# EAGLE design 12input (EAGLE 6.5.0)
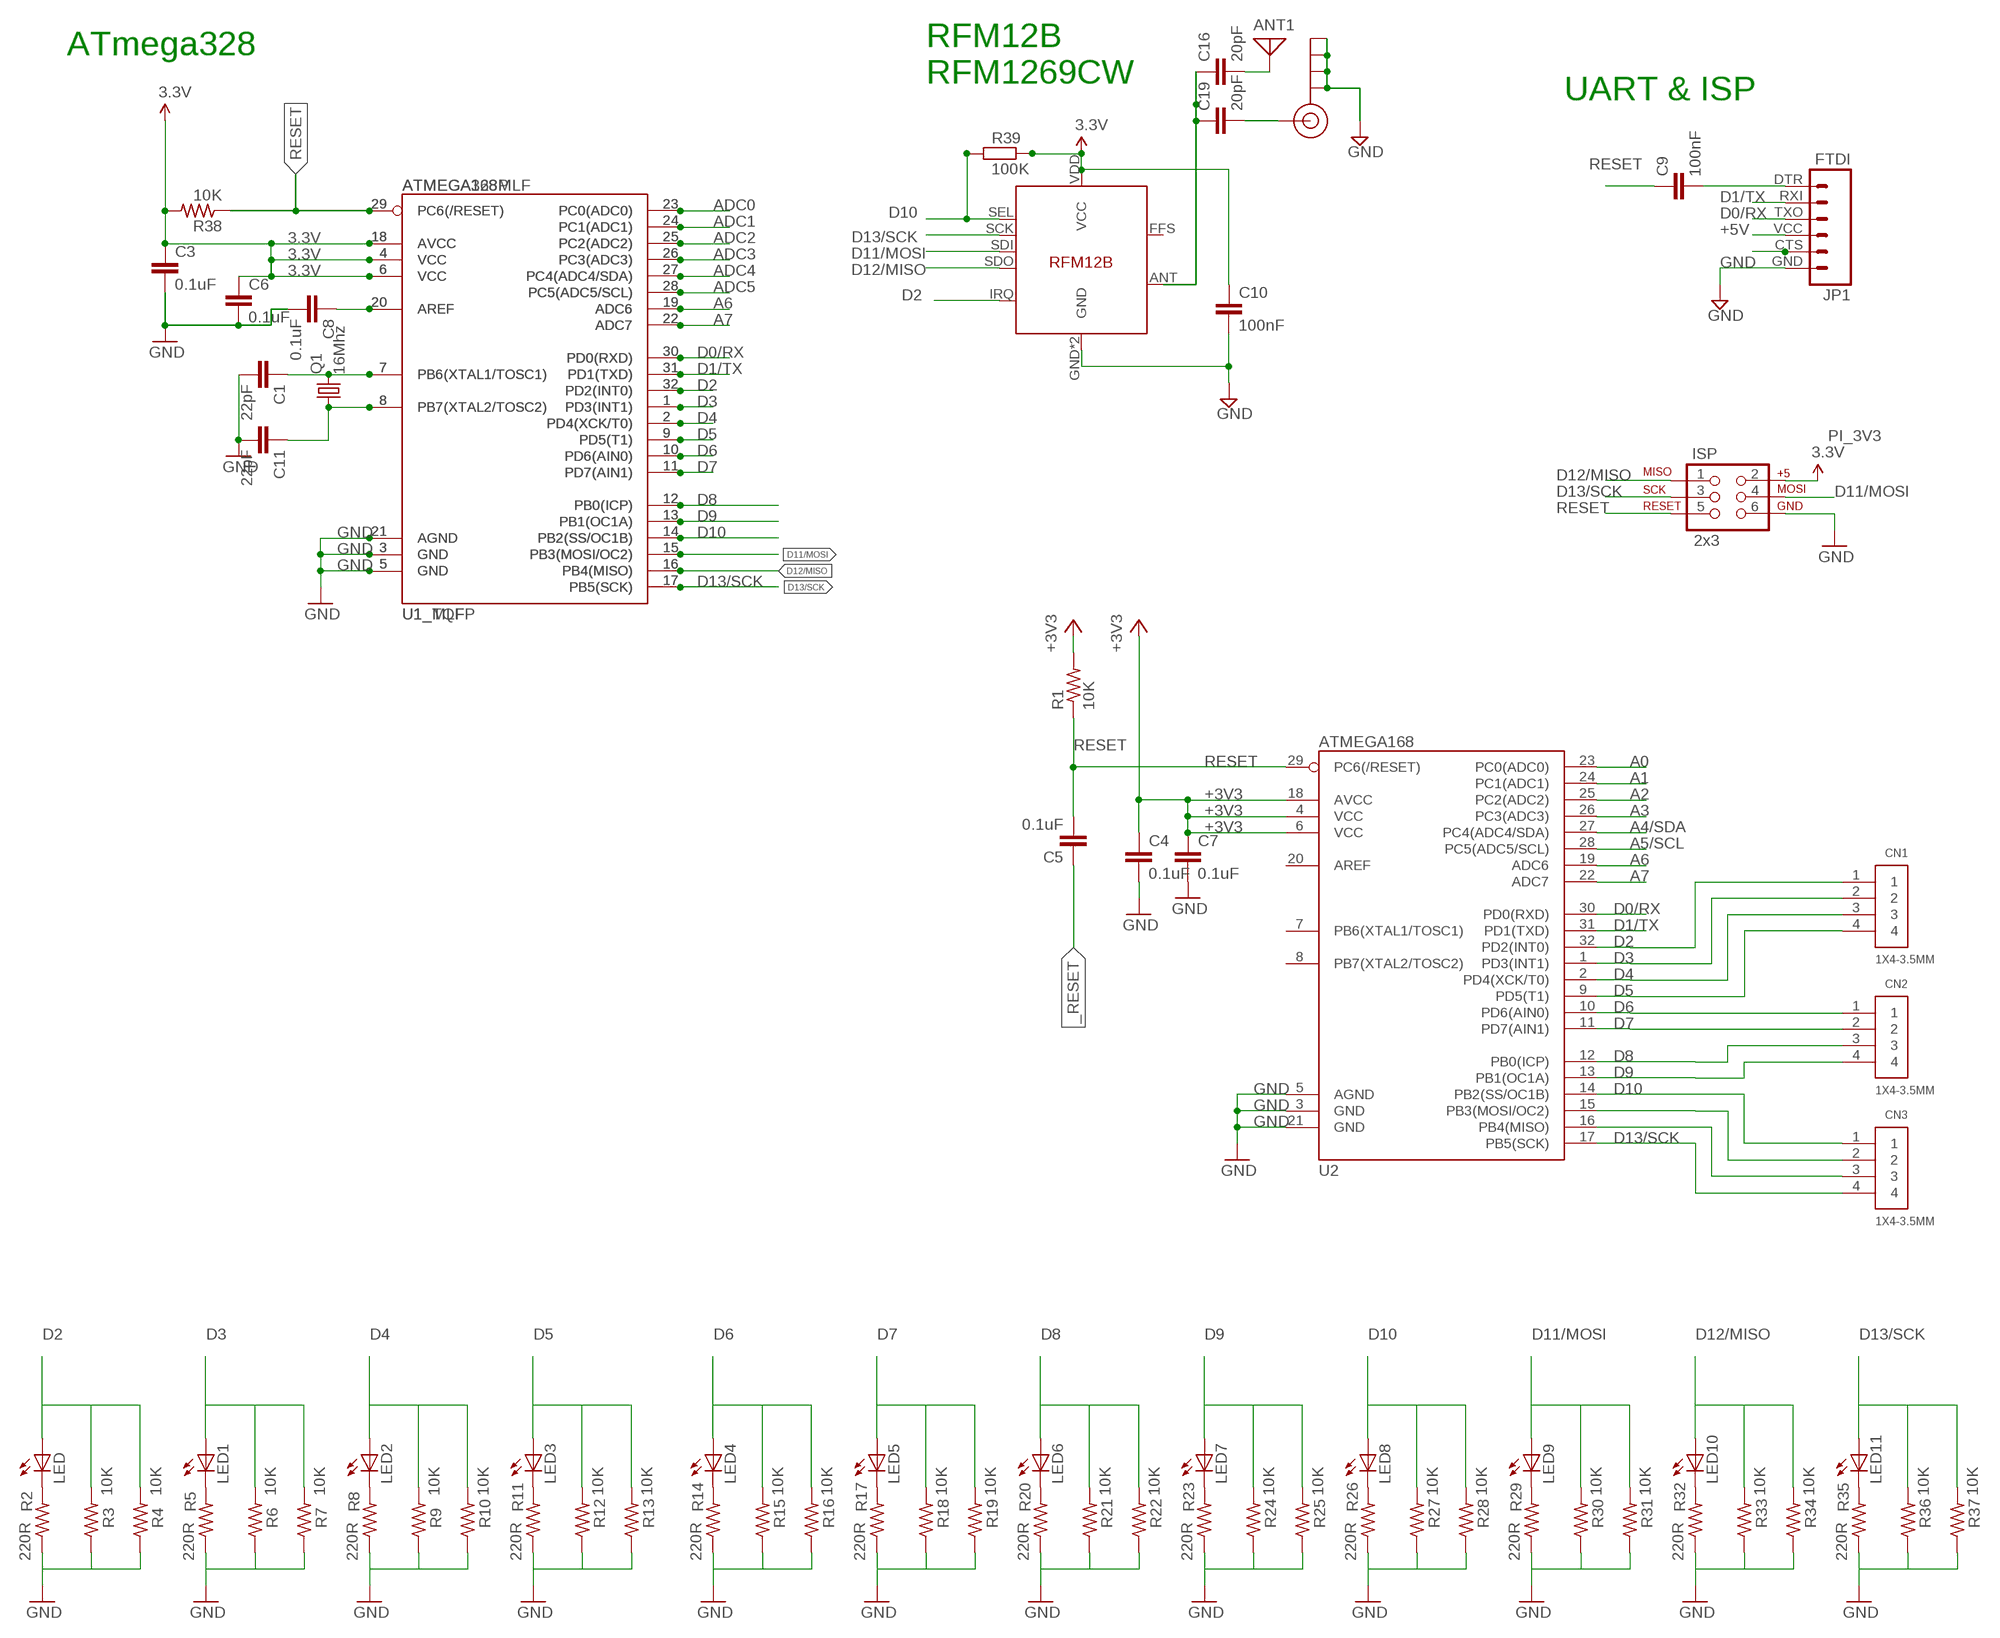
[diagram p0: schematic, sheet 1]

## Parts
ANT1  ANTENNA  [PAD-01]
C1  22pF  C-EUC0603  [C0603]
C3  0.1uF  C-EUC0603  [C0603]
C4  0.1uF  C-EUC0603  [C0603]
C5  0.1uF  C-EUC0603  [C0603]
C6  0.1uF  C-EUC0603  [C0603]
C7  0.1uF  C-EUC0603  [C0603]
C8  0.1uF  C-EUC0603  [C0603]
C9  100nF  C-EUC0603  [C0603]
C10  100nF  C-EUC0603  [C0603]
C11  22pF  C-EUC0603  [C0603]
C16  20pF  C-EUC0603  [C0603]
C19  20pF  C-EUC0603  [C0603]
CN1  1X4-3.5MM  [1X04-3.5MM]
CN2  1X4-3.5MM  [1X04-3.5MM]
CN3  1X4-3.5MM  [1X04-3.5MM]
ISP  2x3  AVR_SPI_PRG_6PTH  [2X3]
J$1  SMA_EDGE  [SMA-EDGE]
JP1  FTDI  FTDI_BASICPTH  [FTDI_BASIC]
LED  LEDSML0603  [SML0603]
LED1  LEDSML0603  [SML0603]
LED2  LEDSML0603  [SML0603]
LED3  LEDSML0603  [SML0603]
LED4  LEDSML0603  [SML0603]
LED5  LEDSML0603  [SML0603]
LED6  LEDSML0603  [SML0603]
LED7  LEDSML0603  [SML0603]
LED8  LEDSML0603  [SML0603]
LED9  LEDSML0603  [SML0603]
LED10  LEDSML0603  [SML0603]
LED11  LEDSML0603  [SML0603]
Q1  16Mhz  CRYSTALHC49UP  [HC49UP]
R1  10K  R-US_R0603  [R0603]
R2  220R  R-US_R0603  [R0603]
R3  10K  R-US_R0603  [R0603]
R4  10K  R-US_0204/7  [0204/7]
R5  220R  R-US_R0603  [R0603]
R6  10K  R-US_R0603  [R0603]
R7  10K  R-US_0204/7  [0204/7]
R8  220R  R-US_R0603  [R0603]
R9  10K  R-US_R0603  [R0603]
R10  10K  R-US_0204/7  [0204/7]
R11  220R  R-US_R0603  [R0603]
R12  10K  R-US_R0603  [R0603]
R13  10K  R-US_0204/7  [0204/7]
R14  220R  R-US_R0603  [R0603]
R15  10K  R-US_R0603  [R0603]
R16  10K  R-US_0204/7  [0204/7]
R17  220R  R-US_R0603  [R0603]
R18  10K  R-US_R0603  [R0603]
R19  10K  R-US_0204/7  [0204/7]
R20  220R  R-US_R0603  [R0603]
R21  10K  R-US_R0603  [R0603]
R22  10K  R-US_0204/7  [0204/7]
R23  220R  R-US_R0603  [R0603]
R24  10K  R-US_R0603  [R0603]
R25  10K  R-US_0204/7  [0204/7]
R26  220R  R-US_R0603  [R0603]
R27  10K  R-US_R0603  [R0603]
R28  10K  R-US_0204/7  [0204/7]
R29  220R  R-US_R0603  [R0603]
R30  10K  R-US_R0603  [R0603]
R31  10K  R-US_0204/7  [0204/7]
R32  220R  R-US_R0603  [R0603]
R33  10K  R-US_R0603  [R0603]
R34  10K  R-US_0204/7  [0204/7]
R35  220R  R-US_R0603  [R0603]
R36  10K  R-US_R0603  [R0603]
R37  10K  R-US_0204/7  [0204/7]
R38  10K  R-US_R0603  [R0603]
R39  100K  R-EU_R0603  [R0603]
U1_MLF  ATMEGA168MLF  [MLF32]
U1_TQFP  ATMEGA328P  ATMEGA328_SMT  [TQFP32-08]
U2  ATMEGA168  [TQFP32-08]
U$14  RFM12B  [RFM12B]

## Nets
3.3V: C3.1 C6.1 C10.1 ISP.2 R38.2 R39.2 U1_MLF.4(VCC) U1_MLF.6(VCC) U1_MLF.18(AVCC) U1_TQFP.4(VCC) U1_TQFP.6(VCC) U1_TQFP.18(AVCC) U$14.VDD(VCC)
+3V3 [power]: C4.1 C7.1 R1.2 U2.4(VCC) U2.6(VCC) U2.18(AVCC)
+5V [power]: JP1.VCC
_RESET: C5.1
A0: U2.23(PC0(ADC0))
A1: U2.24(PC1(ADC1))
A2: U2.25(PC2(ADC2))
A3: U2.26(PC3(ADC3))
A4/SDA: U2.27(PC4(ADC4/SDA))
A5/SCL: U2.28(PC5(ADC5/SCL))
A6: U1_MLF.19(ADC6) U1_TQFP.19(ADC6) U2.19(ADC6)
A7: U1_MLF.22(ADC7) U1_TQFP.22(ADC7) U2.22(ADC7)
ADC0: U1_MLF.23(PC0(ADC0)) U1_TQFP.23(PC0(ADC0))
ADC1: U1_MLF.24(PC1(ADC1)) U1_TQFP.24(PC1(ADC1))
ADC2: U1_MLF.25(PC2(ADC2)) U1_TQFP.25(PC2(ADC2))
ADC3: U1_MLF.26(PC3(ADC3)) U1_TQFP.26(PC3(ADC3))
ADC4: U1_MLF.27(PC4(ADC4/SDA)) U1_TQFP.27(PC4(ADC4/SDA))
ADC5: U1_MLF.28(PC5(ADC5/SCL)) U1_TQFP.28(PC5(ADC5/SCL))
D0/RX: JP1.TXO U1_MLF.30(PD0(RXD)) U1_TQFP.30(PD0(RXD)) U2.30(PD0(RXD))
D1/TX: JP1.RXI U1_MLF.31(PD1(TXD)) U1_TQFP.31(PD1(TXD)) U2.31(PD1(TXD))
D2: CN1.1 LED.A R3.2 R4.2 U1_MLF.32(PD2(INT0)) U1_TQFP.32(PD2(INT0)) U2.32(PD2(INT0)) U$14.IRQ
D3: CN1.2 LED1.A R6.2 R7.2 U1_MLF.1(PD3(INT1)) U1_TQFP.1(PD3(INT1)) U2.1(PD3(INT1))
D4: CN1.3 LED2.A R9.2 R10.2 U1_MLF.2(PD4(XCK/T0)) U1_TQFP.2(PD4(XCK/T0)) U2.2(PD4(XCK/T0))
D5: CN1.4 LED3.A R12.2 R13.2 U1_MLF.9(PD5(T1)) U1_TQFP.9(PD5(T1)) U2.9(PD5(T1))
D6: CN2.1 LED4.A R15.2 R16.2 U1_MLF.10(PD6(AIN0)) U1_TQFP.10(PD6(AIN0)) U2.10(PD6(AIN0))
D7: CN2.2 LED5.A R18.2 R19.2 U1_MLF.11(PD7(AIN1)) U1_TQFP.11(PD7(AIN1)) U2.11(PD7(AIN1))
D8: CN2.3 LED6.A R21.2 R22.2 U1_MLF.12(PB0(ICP)) U1_TQFP.12(PB0(ICP)) U2.12(PB0(ICP))
D9: CN2.4 LED7.A R24.2 R25.2 U1_MLF.13(PB1(OC1A)) U1_TQFP.13(PB1(OC1A)) U2.13(PB1(OC1A))
D10: CN3.1 LED8.A R27.2 R28.2 R39.1 U1_MLF.14(PB2(SS/OC1B)) U1_TQFP.14(PB2(SS/OC1B)) U2.14(PB2(SS/OC1B)) U$14.SEL
D11/MOSI: CN3.2 ISP.4 LED9.A R30.2 R31.2 U1_MLF.15(PB3(MOSI/OC2)) U1_TQFP.15(PB3(MOSI/OC2)) U2.15(PB3(MOSI/OC2)) U$14.SDI
D12/MISO: CN3.3 ISP.1 LED10.A R33.2 R34.2 U1_MLF.16(PB4(MISO)) U1_TQFP.16(PB4(MISO)) U2.16(PB4(MISO)) U$14.SDO
D13/SCK: CN3.4 ISP.3 LED11.A R36.2 R37.2 U1_MLF.17(PB5(SCK)) U1_TQFP.17(PB5(SCK)) U2.17(PB5(SCK)) U$14.SCK
DIG1: C16.1 C19.1 U$14.ANT
GND [power]: C1.2 C3.2 C4.2 C6.2 C7.2 C8.2 C10.2 C11.2 ISP.6 J$1.GND@0(GND) J$1.GND@1(GND) J$1.GND@2(GND) J$1.GND@3(GND) JP1.GND R2.1 R3.1 R4.1 R5.1 R6.1 R7.1 R8.1 R9.1 R10.1 R11.1 R12.1 R13.1 R14.1 R15.1 R16.1 R17.1 R18.1 R19.1 R20.1 R21.1 R22.1 R23.1 R24.1 R25.1 R26.1 R27.1 R28.1 R29.1 R30.1 R31.1 R32.1 R33.1 R34.1 R35.1 R36.1 R37.1 U1_MLF.3(GND) U1_MLF.5(GND) U1_MLF.21(AGND) U1_TQFP.3(GND) U1_TQFP.5(GND) U1_TQFP.21(AGND) U2.3(GND) U2.5(AGND) U2.21(GND) U$14.GND U$14.P$12(GND)
N$1: C1.1 Q1.2 U1_MLF.7(PB6(XTAL1/TOSC1)) U1_TQFP.7(PB6(XTAL1/TOSC1))
N$2: LED1.C R5.2
N$3: LED.C R2.2
N$4: C11.1 Q1.1 U1_MLF.8(PB7(XTAL2/TOSC2)) U1_TQFP.8(PB7(XTAL2/TOSC2))
N$5: ANT1.1 C16.2
N$6: JP1.CTS
N$7: LED2.C R8.2
N$8: C9.2 JP1.DTR
N$9: LED3.C R11.2
N$11: LED4.C R14.2
N$13: LED5.C R17.2
N$15: LED6.C R20.2
N$17: LED7.C R23.2
N$19: LED8.C R26.2
N$20: C8.1 U1_MLF.20(AREF) U1_TQFP.20(AREF)
N$21: LED9.C R29.2
N$23: LED10.C R32.2
N$24: C19.2 J$1.SIG(SIGNAL)
N$25: LED11.C R35.2
RESET: C5.2 C9.1 ISP.5 R1.1 R38.1 U1_MLF.29(PC6(/RESET)) U1_TQFP.29(PC6(/RESET)) U2.29(PC6(/RESET))
Unconnected: U2.7(PB6(XTAL1/TOSC1)) U2.8(PB7(XTAL2/TOSC2)) U2.20(AREF) U$14.FFS

## Notes on the sheet
- ATmega328
- RFM12B
  RFM1269CW
- UART & ISP

## Library data of the parts
ANT1 = discrete:ANTENNA: Antenna
C1 C6-C8 C11 = resistor:C-EU: CAPACITOR, European symbol
C3-C5 C9 C10 C16 C19 = rcl:C-EU: CAPACITOR, European symbol
CN1-CN3 = adafruit:1X4: 4-pin connector
ISP = SparkFun:AVR_SPI_PRG_6: AVR ISP 6 Pin This is the reduced ISP connector for AVR programming. Common on Arduino. This footprint will take up less PCB space and can be used with a 10-pin to 6-pin adapter such as SKU: BOB-08508
J$1 = SparkFun-Connectors:SMA_EDGE: SMA Antenna Connector End launch SMA connector. The paste layer has been removed so that the connector can be hand soldered onto the board after reflow.
JP1 = SparkFun:FTDI_BASIC: FTDI Basic: 3.3V and 5V
LED LED1-LED11 = led:LED: LED OSRAM: - CHIPLED LG R971, LG N971, LY N971, LG Q971, LY Q971, LO R971, LY R971 LH N974, LH R974 LS Q976, LO Q976, LY Q976 LO Q996 - Hyper CHIPLED LW Q18S LB Q993, LB Q99A, LB R99A - SideLED LS A670, LO A670, LY A670, LG A670, LP A670 LB A673, LV A673, LT A673, LW A673 LH A674 LY A675 LS A676, LA A676, LO A676, LY A676, LW A676 LS A679, LY A679, LG A679 - Hyper Micro SIDELED® LS Y876, LA Y876, LO Y876, LY Y876 LT Y87S - SmartLED LW L88C, LW L88S LB L89C, LB L89S, LG L890 LS L89K, LO L89K, LY L89K LS L896, LA L896, LO L896, LY L896 - TOPLED LS T670, LO T670, LY T670, LG T670, LP T670 LSG T670, LSP T670, LSY T670, LOP T670, LYG T670 LG T671, LOG T671, LSG T671 LB T673, LV T673, LT T673, LW T673 LH T674 LS T676, LA T676, LO T676, LY T676, LB T676, LH T676, LSB T676, LW T676 LB T67C, LV T67C, LT T67C, LS T67K, LO T67K, LY T67K, LW E67C LS E67B, LA E67B, LO E67B, LY E67B, LB E67C, LV E67C, LT E67C LW T67C LS T679, LY T679, LG T679 LS T770, LO T770, LY T770, LG T770, LP T770 LB T773, LV T773, LT T773, LW T773 LH T774 LS E675, LA E675, LY E675, LS T675 LS T776, LA T776, LO T776, LY T776, LB T776 LHGB T686 LT T68C, LB T68C - Hyper Mini TOPLED® LB M676 - Mini TOPLED Santana® LG M470 LS M47K, LO M47K, LY M47K Source: http://www.osram.convergy.de LUXEON: - LUMILED® LXK2-PW12-R00, LXK2-PW12-S00, LXK2-PW14-U00, LXK2-PW14-V00 LXK2-PM12-R00, LXK2-PM12-S00, LXK2-PM14-U00 LXK2-PE12-Q00, LXK2-PE12-R00, LXK2-PE12-S00, LXK2-PE14-T00, LXK2-PE14-U00 LXK2-PB12-K00, LXK2-PB12-L00, LXK2-PB12-M00, LXK2-PB14-N00, LXK2-PB14-P00, LXK2-PB14-Q00 LXK2-PR12-L00, LXK2-PR12-M00, LXK2-PR14-Q00, LXK2-PR14-R00 LXK2-PD12-Q00, LXK2-PD12-R00, LXK2-PD12-S00 LXK2-PH12-R00, LXK2-PH12-S00 LXK2-PL12-P00, LXK2-PL12-Q00, LXK2-PL12-R00 Source: www.luxeon.com KINGBRIGHT: KA-3528ASYC Source: www.kingbright.com
Q1 = adafruit:CRYSTAL: CRYSTAL; OC_FARNELL: unknown; OC_NEWARK: unknown
R1-R38 = adafruit:R-US_: RESISTOR, American symbol
R39 = rcl:R-EU_: RESISTOR, European symbol
U1_MLF = SparkFun-DigitalIC:ATMEGA168: Atmel 32-pin 8-bit micro, 16k flash.
U1_TQFP = SparkFun-DigitalIC:ATMEGA328_SMT: 32-Pin Atmega328 part Commonly used on Arduino compatible boards Available in QFP and QFN packages TQFP is IC-09069 QFN is non-stock; PROD_ID: IC-09069
U2 = SparkFun:ATMEGA168
U$14 = JeeParts:RFM12B

## Net classes
0 default: width 0.203 mm, drill 0.6 mm, clearance 0.203 mm
1 power: width 0.305 mm, drill 0.6 mm, clearance 0.254 mm
2 gnd: width 0.254 mm, drill 0.6 mm, clearance 0.254 mm

## Board
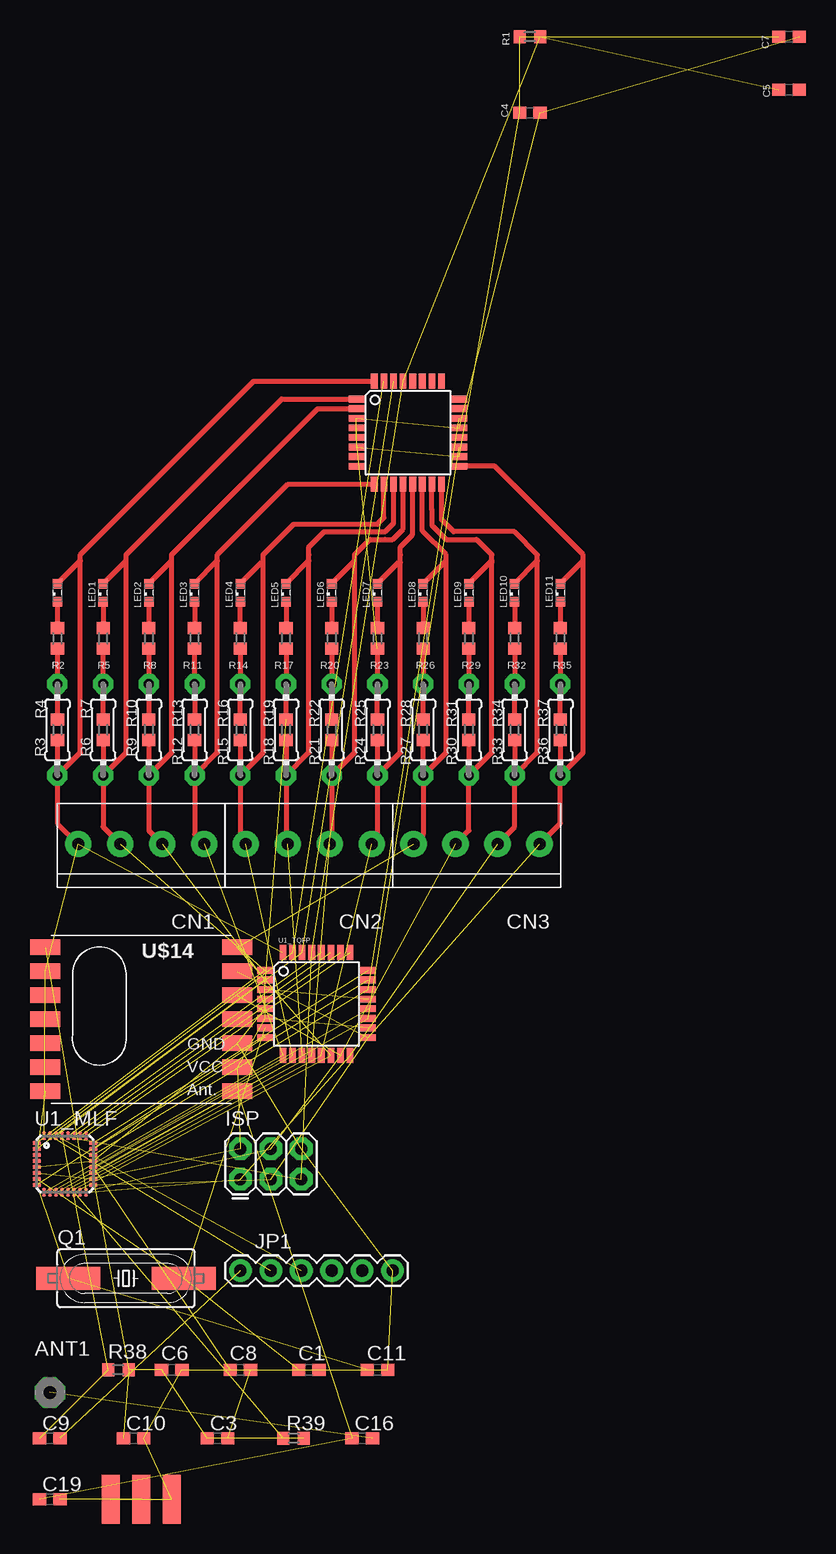
[diagram p1: board, top side]
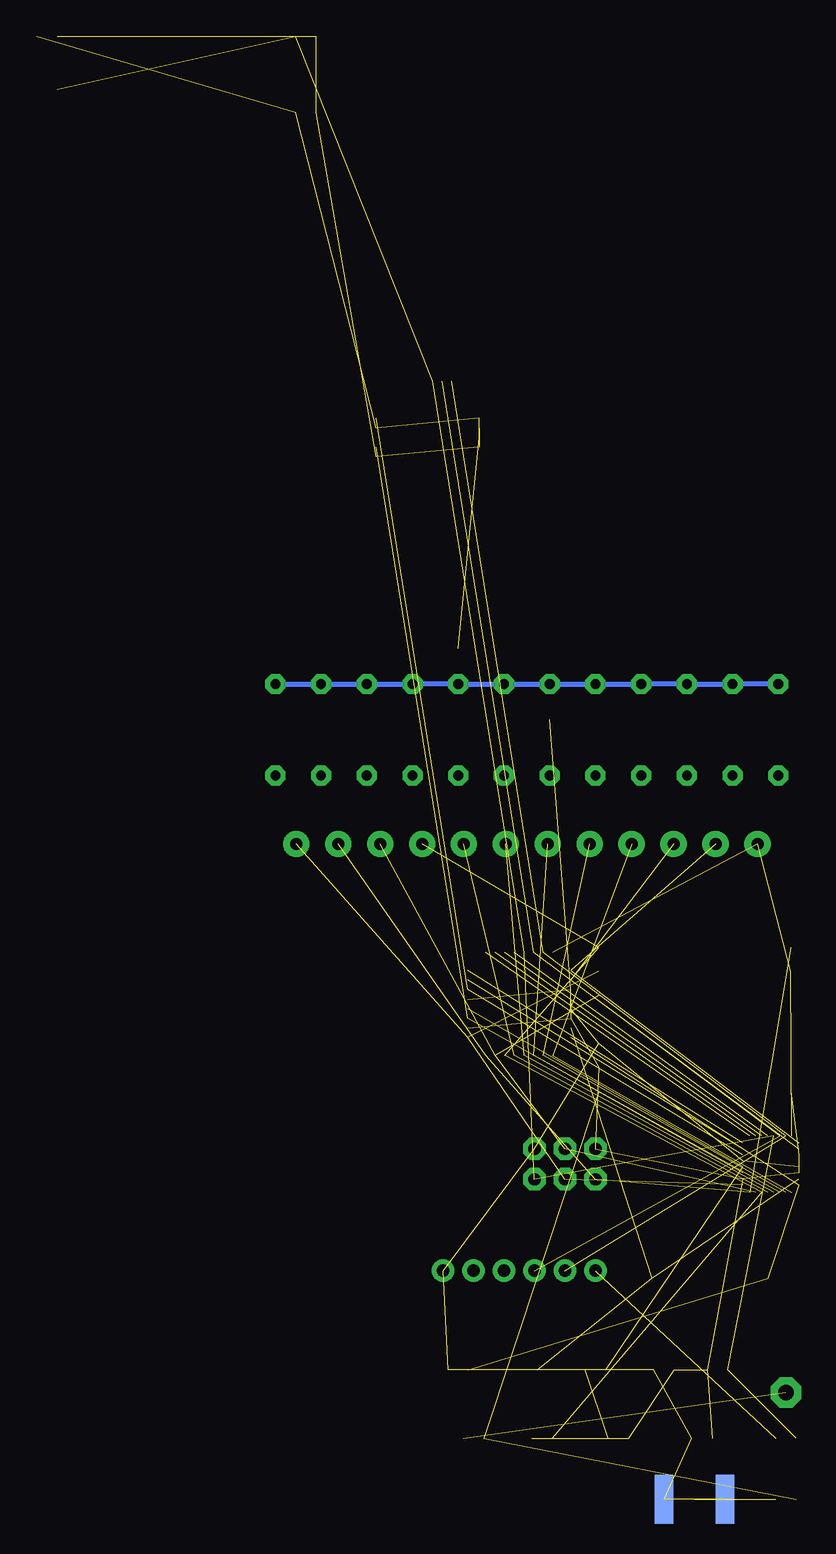
[diagram p2: board, bottom side, seen from below]

No outline drawn. Coordinates in mm, seen from the top.
Copper layers (1*16): Top 0.035mm / dielectric 1.5mm / Bottom 0.035mm
Design rules "default *": minimum track width 8mil, minimum drill 0.6mm, track to track 8mil, track to pad 8mil, pad to pad 8mil, via to via 8mil, smd to smd 5mil, copper to edge 8mil, drill to drill 8mil, minimum pad ring 12mil, minimum via ring 8mil, stop-mask expansion 4mil, vias tented up to drill 0.6mm, thermal gap 8mil

### Footprints (pad centres in the part's own frame; a part is rotated, then mirrored left to right if it is on the bottom)
PAD-01 = drill 1.321 pad 2.54 octagon: 1 0,0
C0603 = smd 1.1 x 1: 1 -0.85,0; 2 0.85,0
1X04-3.5MM = drill 1 pad 2.184: 1 -5.25,0; 2 -1.75,0; 3 1.75,0; 4 5.25,0
2X3 = drill 1.016 pad 1.88 octagon: 1 0,0; 2 0,2.54; 3 2.54,0; 4 2.54,2.54; 5 5.08,0; 6 5.08,2.54
SMA-EDGE = smd 1.524 x 4.064: GND@0 0,0; GND@1 5.08,0; SIG 2.54,0 | smd 1.524 x 4.064 bottom: GND@2 0,0; GND@3 5.08,0
FTDI_BASIC = drill 1.016 pad 1.88: CTS 10.16,0; DTR 0,0; GND 12.7,0; RXI 2.54,0; TXO 5.08,0; VCC 7.62,0
SML0603 = smd 0.8 x 0.8: A 0.75,0; C -0.75,0
HC49UP = smd 5.334 x 1.93: 1 -4.826,0; 2 4.826,0
R0603 = smd 1 x 1.1: 1 -0.85,0; 2 0.85,0
0204/7 = drill 0.813 pad 1.676 octagon: 1 -3.81,0; 2 3.81,0
MLF32 = smd 0.7 x 0.3: 1 -2.35,1.75; 2 -2.35,1.25; 3 -2.35,0.75; 4 -2.35,0.25; 5 -2.35,-0.25; 6 -2.35,-0.75; 7 -2.35,-1.25; 8 -2.35,-1.75; 17 2.35,-1.75; 18 2.35,-1.25; 19 2.35,-0.75; 20 2.35,-0.25; 21 2.35,0.25; 22 2.35,0.75; 23 2.35,1.25; 24 2.35,1.75 | smd 0.3 x 0.7: 9 -1.75,-2.35; 10 -1.25,-2.35; 11 -0.75,-2.35; 12 -0.25,-2.35; 13 0.25,-2.35; 14 0.75,-2.35; 15 1.25,-2.35; 16 1.75,-2.35; 25 1.75,2.35; 26 1.25,2.35; 27 0.75,2.35; 28 0.25,2.35; 29 -0.25,2.35; 30 -0.75,2.35; 31 -1.25,2.35; 32 -1.75,2.35
TQFP32-08 = smd 1.27 x 0.559: 1 -4.293,2.8; 2 -4.293,2; 3 -4.293,1.2; 4 -4.293,0.4; 5 -4.293,-0.4; 6 -4.293,-1.2; 7 -4.293,-2; 8 -4.293,-2.8; 17 4.293,-2.8; 18 4.293,-2; 19 4.293,-1.2; 20 4.293,-0.4; 21 4.293,0.4; 22 4.293,1.2; 23 4.293,2; 24 4.293,2.8 | smd 0.559 x 1.27: 9 -2.8,-4.293; 10 -2,-4.293; 11 -1.2,-4.293; 12 -0.4,-4.293; 13 0.4,-4.293; 14 1.2,-4.293; 15 2,-4.293; 16 2.8,-4.293; 25 2.8,4.293; 26 2,4.293; 27 1.2,4.293; 28 0.4,4.293; 29 -0.4,4.293; 30 -1.2,4.293; 31 -2,4.293; 32 -2.8,4.293
RFM12B = smd 2.54 x 1.27: ANT 8,-6; FFS -8,2; GND 8,-2; IRQ -8,4; P$8 -8,0; P$9 -8,-2; P$10 -8,-4; P$12 -8,-6; P$16 8,0; SCK 8,4; SDI 8,2; SDO -8,6; SEL 8,6; VDD 8,-4

### Placement (x,y rotation side)
ANT1  1.91,-39.37 0 top
C1  23.5,-37.47 0 top
C3  15.88,-43.18 0 top
C4  41.91,67.31 0 top
C5  63.5,69.22 180 top
C6  12.06,-37.47 0 top
C7  63.5,73.66 0 top
C8  17.78,-37.47 0 top
C9  1.91,-43.18 0 top
C10  8.89,-43.18 0 top
C11  29.21,-37.47 0 top
C16  27.94,-43.18 0 top
C19  1.91,-48.26 0 top
CN1  9.53,6.35 0 top
CN2  23.5,6.35 0 top
CN3  37.47,6.35 0 top
ISP  17.78,-21.59 0 top
J$1  6.99,-48.26 0 top
JP1  17.78,-29.21 0 top
LED  2.54,27.3 90 top
LED1  6.35,27.3 90 top
LED2  10.16,27.3 90 top
LED3  13.97,27.3 90 top
LED4  17.78,27.3 90 top
LED5  21.59,27.3 90 top
LED6  25.4,27.3 90 top
LED7  29.21,27.3 90 top
LED8  33.02,27.3 90 top
LED9  36.83,27.3 90 top
LED10  40.64,27.3 90 top
LED11  44.45,27.3 90 top
Q1  8.26,-29.84 0 top
R1  41.91,73.66 180 top
R2  2.54,23.5 90 top
R3  2.54,15.88 270 top
R4  2.54,15.88 270 top
R5  6.35,23.5 90 top
R6  6.35,15.88 270 top
R7  6.35,15.88 270 top
R8  10.16,23.5 90 top
R9  10.16,15.88 270 top
R10  10.16,15.88 270 top
R11  13.97,23.5 90 top
R12  13.97,15.88 270 top
R13  13.97,15.88 270 top
R14  17.78,23.5 90 top
R15  17.78,15.88 270 top
R16  17.78,15.88 270 top
R17  21.59,23.5 90 top
R18  21.59,15.88 270 top
R19  21.59,15.88 270 top
R20  25.4,23.5 90 top
R21  25.4,15.88 270 top
R22  25.4,15.88 270 top
R23  29.21,23.5 90 top
R24  29.21,15.88 270 top
R25  29.21,15.88 270 top
R26  33.02,23.5 90 top
R27  33.02,15.88 270 top
R28  33.02,15.88 270 top
R29  36.83,23.5 90 top
R30  36.83,15.88 270 top
R31  36.83,15.88 270 top
R32  40.64,23.5 90 top
R33  40.64,15.88 270 top
R34  40.64,15.88 270 top
R35  44.45,23.5 90 top
R36  44.45,15.88 270 top
R37  44.45,15.88 270 top
R38  7.62,-37.47 0 top
R39  22.23,-43.18 0 top
U1_MLF  3.17,-20.32 0 top
U1_TQFP  24.13,-6.99 0 top
U2  31.75,40.64 0 top
U$4  [OSHW_6X200_NOTEXT]  84.96,60.58 0 bottom
U$14  9.53,-8.26 0 top

### Tracks (layer width: path | path; a pad name or v marks a point on that pad's centre or on a via)
3.3V  (12 unrouted)
+3V3  (5 unrouted)
A6  (2 unrouted)
A7  (2 unrouted)
ADC0  (1 unrouted)
ADC1  (1 unrouted)
ADC2  (1 unrouted)
ADC3  (1 unrouted)
ADC4  (1 unrouted)
ADC5  (1 unrouted)
D0/RX  (3 unrouted)
D1/TX  (3 unrouted)
D2  (3 unrouted)
  Top 0.406: R4.2 4.45,13.97 4.45,30.48 | LED.A 4.45,29.96 4.45,30.48 | R3.2 R4.2 | R4.2 2.54,8.09 CN1.1 | 4.45,30.48 18.9,44.93 U2.32
D3  (2 unrouted)
  Top 0.406: R7.2 8.26,13.97 8.26,30.48 | LED1.A 8.26,29.96 8.26,30.48 | R6.2 R7.2 | R7.2 6.35,7.78 CN1.2 | 8.26,30.48 21.21,43.44 U2.1
D4  (2 unrouted)
  Top 0.406: R9.2 R10.2 | R10.2 12.06,13.97 12.06,30.48 | LED2.A 12.06,29.96 12.06,30.48 | R10.2 10.16,7.46 CN1.3 | 12.06,30.48 24.23,42.64 U2.2
D5  (2 unrouted)
  Top 0.406: R13.2 15.88,13.97 15.88,30.48 | LED3.A 15.88,29.96 15.88,30.48 | R12.2 R13.2 | R13.2 13.97,7.16 CN1.4 | 15.88,30.48 21.74,36.35 U2.9
D6  (2 unrouted)
  Top 0.406: R16.2 19.68,13.97 19.68,29.84 | 19.68,29.84 19.68,30.48 22.23,33.02 29.21,33.02 29.75,33.56 U2.10 | LED4.A 19.57,29.84 19.68,29.84 | R15.2 R16.2 | R16.2 17.78,6.82 CN2.1
D7  (2 unrouted)
  Top 0.406: R19.2 23.5,13.97 23.5,30.48 | LED5.A 23.5,29.96 23.5,30.48 | R18.2 R19.2 | R19.2 21.59,6.5 CN2.2 | 23.5,30.48 23.5,31.11 24.77,32.38 29.84,32.38 30.48,33.02 30.55,33.09 U2.11
D8  (2 unrouted)
  Top 0.406: R22.2 27.3,13.97 27.3,30.48 | LED6.A 27.3,29.96 27.3,30.48 | R21.2 R22.2 | R22.2 25.4,6.5 CN2.3 | 27.3,30.48 28.57,31.75 29.84,31.75 30.48,31.75 31.35,32.62 U2.12
D9  (2 unrouted)
  Top 0.406: R25.2 31.11,13.97 31.11,29.84 | 31.11,29.84 31.11,30.48 31.11,31.11 32.15,32.15 U2.13 | LED7.A 31,29.84 31.11,29.84 | R24.2 R25.2 | R25.2 29.21,6.82 CN2.4
D10  (4 unrouted)
  Top 0.406: R28.2 34.92,13.97 34.92,30.48 | LED8.A 34.92,29.96 34.92,30.48 | R28.2 R27.2 | R28.2 33.02,7.16 CN3.1 | 34.92,30.48 32.95,32.45 U2.14
D11/MOSI  (4 unrouted)
  Top 0.406: R31.2 38.73,13.97 38.73,29.84 38.73,30.48 | LED9.A 38.73,29.96 38.73,30.48 | R30.2 R31.2 | CN3.2 36.83,7.46 R31.2 | U2.15 33.75,34.2 33.75,32.92 34.92,31.75 37.47,31.75 38.73,30.48
D12/MISO  (4 unrouted)
  Top 0.406: R34.2 42.55,13.97 42.55,30.48 | LED10.A 42.55,29.96 42.55,30.48 | R33.2 R34.2 | CN3.3 40.64,7.78 R34.2 | 42.55,30.48 40.64,32.38 35.56,32.38 34.55,33.4 U2.16
D13/SCK  (4 unrouted)
  Top 0.406: R37.2 46.35,13.97 46.35,30.48 | LED11.A 46.35,29.96 46.35,30.48 | R36.2 R37.2 | 46.35,30.48 38.99,37.84 U2.17 | CN3.4 44.45,8.09 R37.2
DIG1  (2 unrouted)
GND  (25 unrouted)
  Top 0.406: R2.1 R4.1 R3.1 | R6.1 R7.1 R5.1 | R12.1 R13.1 R11.1 | R9.1 R10.1 R8.1 | R35.1 R37.1 R36.1 | R32.1 R34.1 R33.1 | R29.1 R31.1 R30.1 | R26.1 R28.1 R27.1 | R23.1 R25.1 R24.1 | R20.1 R22.1 R21.1 | R17.1 R19.1 R18.1 | 17.78,22.86 R14.1 R16.1 R15.1
  Bottom 0.406: R4.1 R7.1 R10.1 R13.1 R16.1 R19.1 R22.1 R25.1 R28.1 R31.1 R34.1 R37.1
N$1  (3 unrouted)
N$2
  Top 0.406: LED1.C R5.2
N$3
  Top 0.406: LED.C R2.2
N$4  (3 unrouted)
N$5  (1 unrouted)
N$7
  Top 0.406: LED2.C R8.2
N$8  (1 unrouted)
N$9
  Top 0.406: LED3.C R11.2
N$11
  Top 0.406: R14.2 LED4.C
N$13
  Top 0.406: LED5.C R17.2
N$15
  Top 0.406: LED6.C R20.2
N$17
  Top 0.406: LED7.C R23.2
N$19
  Top 0.406: LED8.C R26.2
N$20  (2 unrouted)
N$21
  Top 0.406: LED9.C R29.2
N$23
  Top 0.406: LED10.C R32.2
N$24  (1 unrouted)
N$25
  Top 0.406: LED11.C R35.2
RESET  (7 unrouted)